# Altium schematic sheet fmc_connector.SchDoc: FMC Connector
size 420 x 297 mm; CheckedBy: MC, TW, EB; CompanyName: CERN; DrawnBy: Greg Kasprowicz; Organization: CERN; Address1: European Organization for Nuclear Research; Address2: CH-1211 Geneve 23 - SwitzerLA_Pd; DocumentNumber: 3; Revision: -; SheetNumber: 3; SheetTotal: 17; EDA_Number: EDA-02189-V4-0; Projet: Simple PCIe Carrier Board; ModifiedBy: TW, MC; CreateDate: 10/07/2010; CheckedDate: 11/05/2011; DivGrp: BE-CO; Designer: GK, MC, TW, EB, PAS; PageSetup: Record=PageOptions|CenterHorizontal=True|CenterVertical=True|PrintScale=0.96|XCorrection=1.00|YCorrection=1.00|PrintKind=1|BorderSize=5000000|LeftOffset=0|BottomOffset=0|Orientation=2|PaperLength=1000|PaperWidth=1000|Scale=100|PaperSource=15|PrintQuality=600|MediaType=1|DitherType=10|PaperKind=A3|PrintScaleMode=1; ModifiedDate: -
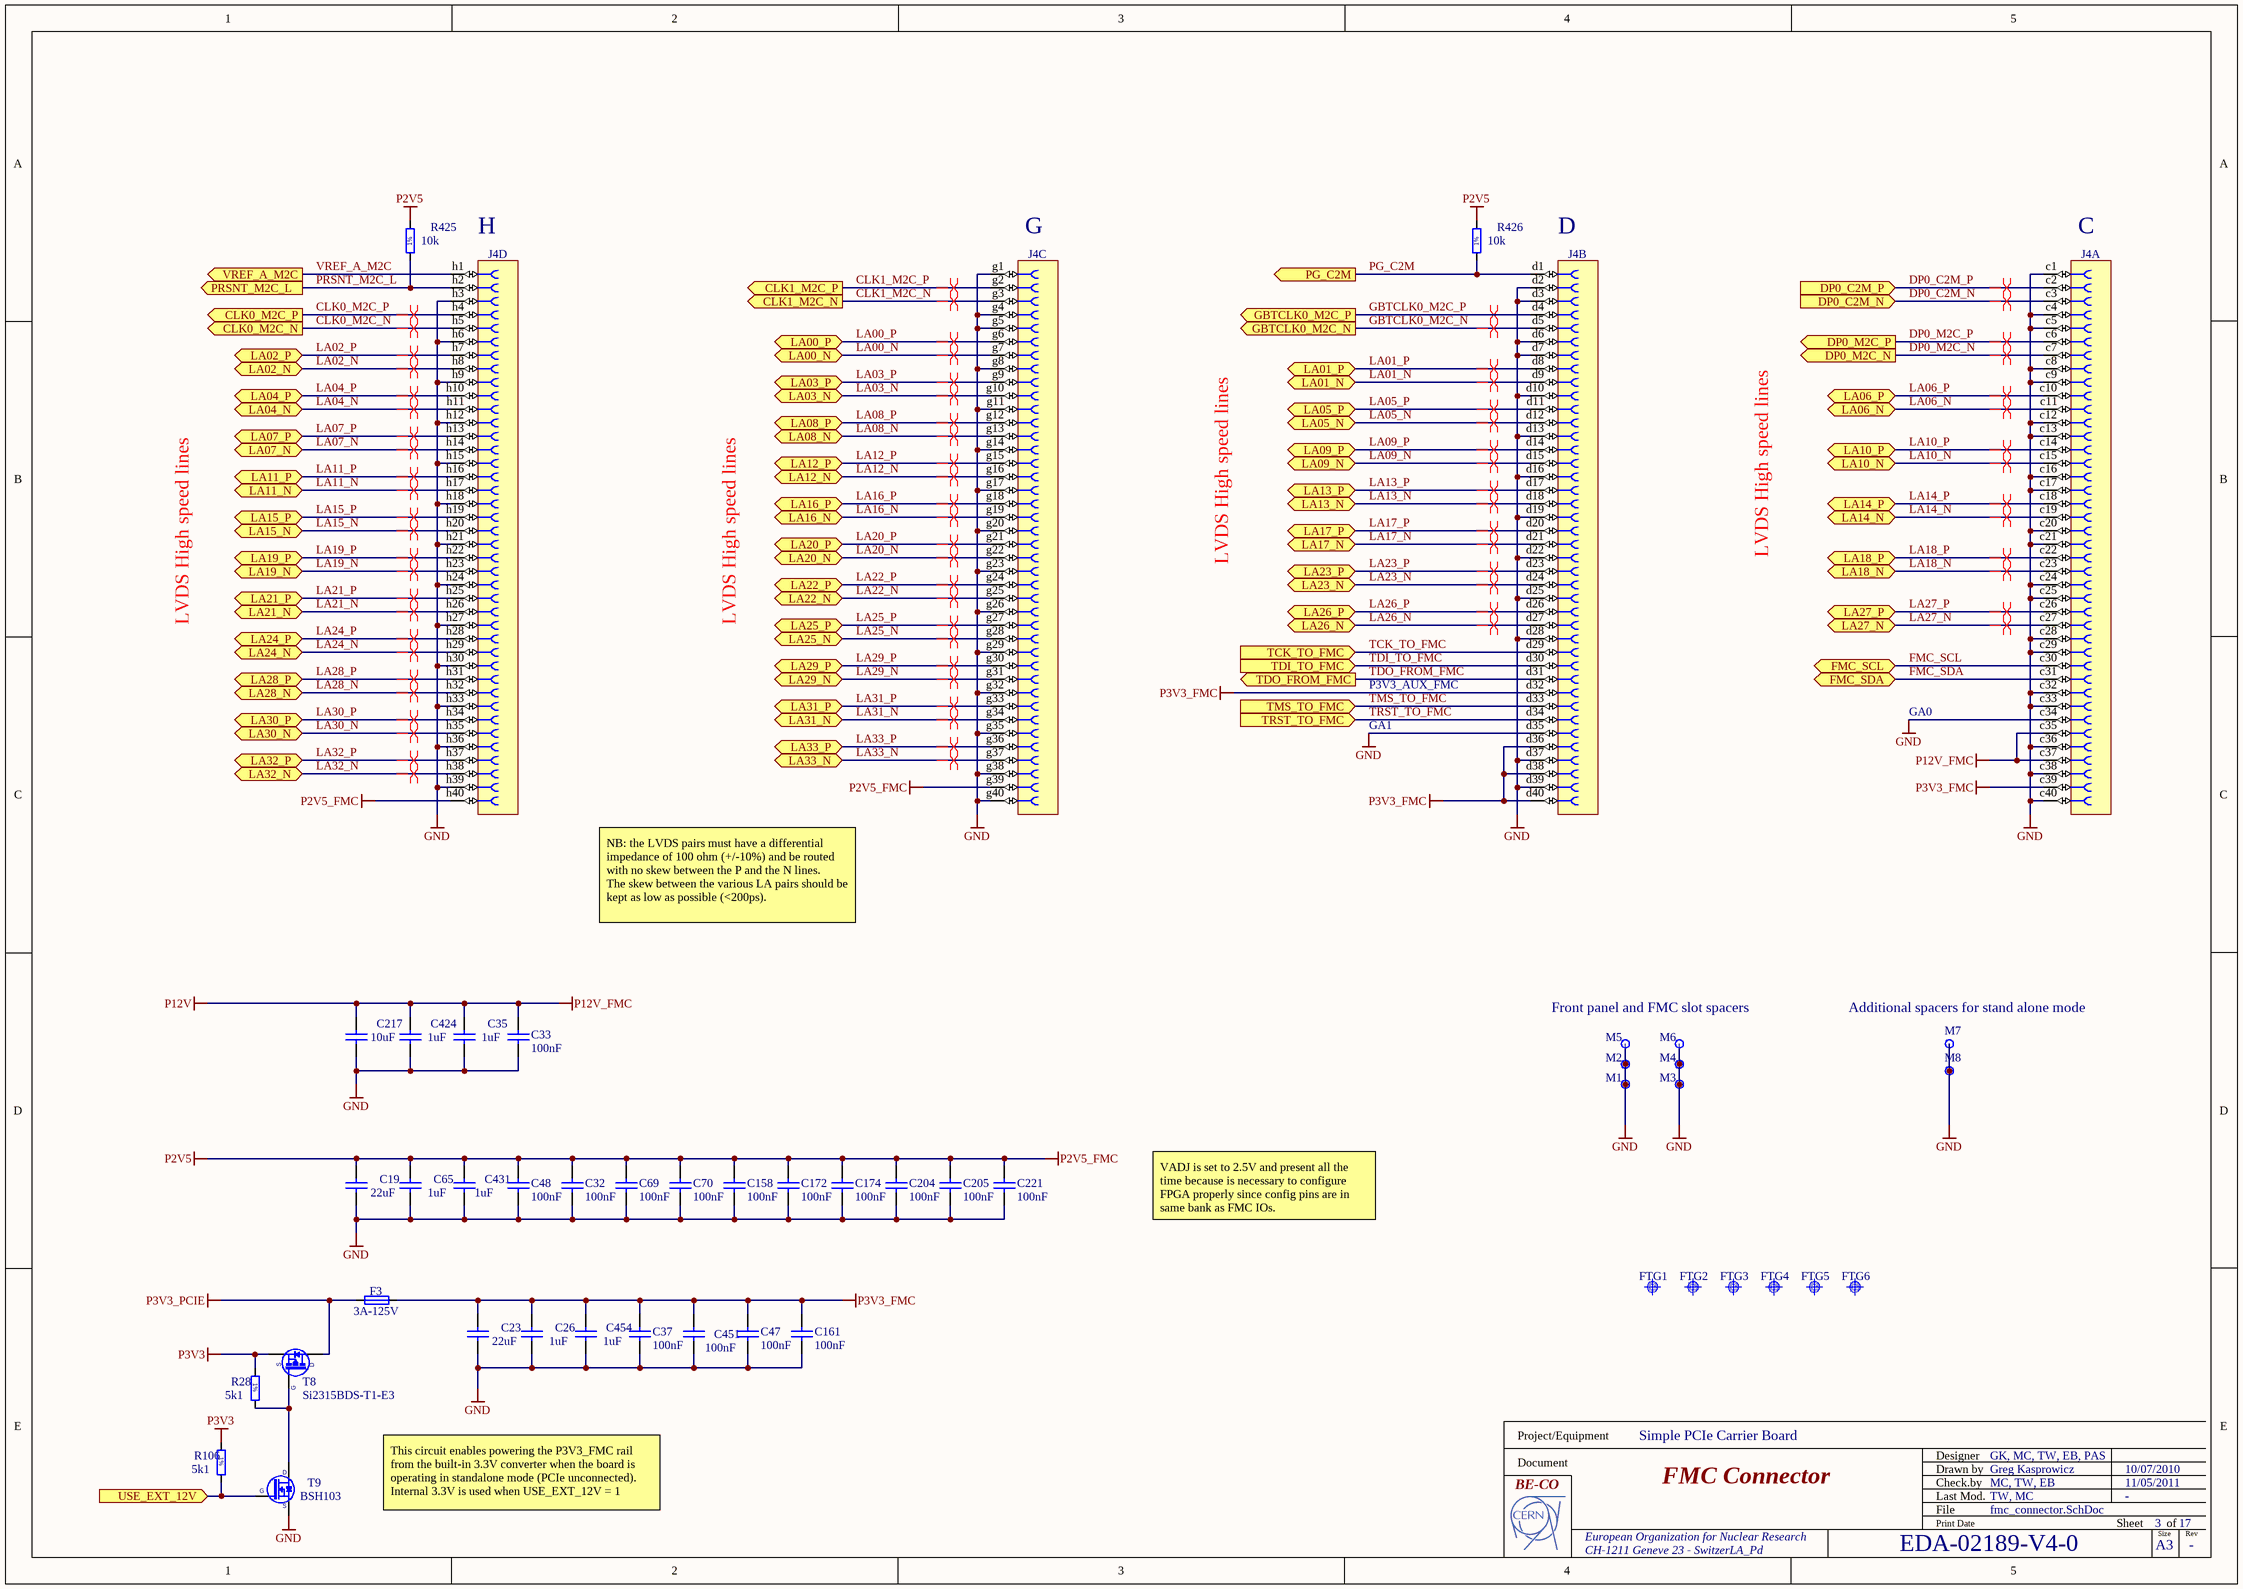
[diagram p0: fmc_connector.SchDoc]

## Parts
C19  22uF  [CAPC3216X180N]
C23  22uF  [CAPC3216X180N]
C26  1uF  [CAPC1608X87N]
C32  100nF  [CAPC1608X87N]
C33  100nF  [CAPC1608X87N]
C35  1uF  [CAPC1608X87N]
C37  100nF  [CAPC1608X87N]
C47  100nF  [CAPC1608X87N]
C48  100nF  [CAPC1608X87N]
C65  1uF  [CAPC1608X87N]
C69  100nF  [CAPC1608X87N]
C70  100nF  [CAPC1608X87N]
C158  100nF  [CAPC1608X87N]
C161  100nF  [CAPC1608X87N]
C172  100nF  [CAPC1608X87N]
C174  100nF  [CAPC1608X87N]
C204  100nF  [CAPC1608X87N]
C205  100nF  [CAPC1608X87N]
C217  10uF  [CAPC3225X270N]
C221  100nF  [CAPC1608X87N]
C424  1uF  [CAPC1608X87N]
C431  1uF  [CAPC1608X87N]
C451  100nF  [CAPC1608X87N]
C454  1uF  [CAPC1608X87N]
F3  3A-125V  [FUSE_LITTELFUSE_0154]
FTG1  Use only in PCB  [FIDUCIAL_TOP_S100-200]  (value not drawn)
FTG2  Use only in PCB  [FIDUCIAL_TOP_S100-200]  (value not drawn)
FTG3  Use only in PCB  [FIDUCIAL_TOP_S100-200]  (value not drawn)
FTG4  Use only in PCB  [FIDUCIAL_TOP_S100-200]  (value not drawn)
FTG5  Use only in PCB  [FIDUCIAL_TOP_S100-200]  (value not drawn)
FTG6  Use only in PCB  [FIDUCIAL_TOP_S100-200]  (value not drawn)
J4  VITA 57  [SAMTEC_ASP-134603-01]  (value not drawn)  (parts A,B,C,D of 4)
M1  Plated Hole  [MTG300_600]  (value not drawn)
M2  Plated Hole  [MTG300_600]  (value not drawn)
M3  Plated Hole  [MTG300_600]  (value not drawn)
M4  Plated Hole  [MTG300_600]  (value not drawn)
M5  Plated Hole  [MTG300_600]  (value not drawn)
M6  Plated Hole  [MTG300_600]  (value not drawn)
M7  Plated Hole  [MTG300_600]  (value not drawn)
M8  Plated Hole  [MTG300_600]  (value not drawn)
R28  5k1  [RESC1608X55N]
R106  5k1  [RESC1608X55N]
R425  10k  [RESC1608X55N]
R426  10k  [RESC1608X55N]
T8  Si2315BDS-T1-E3  [SOT95P237X112-3N]
T9  BSH103  [SOT95P230X110-3N]

## Ports
CLK0_M2C_N (out), CLK0_M2C_P (out), CLK1_M2C_N (out), CLK1_M2C_P (out), DP0_C2M_N (in), DP0_C2M_P (in), DP0_M2C_N (out), DP0_M2C_P (out), FMC_SCL (bidir), FMC_SDA (bidir), GBTCLK0_M2C_N (out), GBTCLK0_M2C_P (out), LA00_N (bidir), LA00_P (bidir), LA01_N (bidir), LA01_P (bidir), LA02_N (bidir), LA02_P (bidir), LA03_N (bidir), LA03_P (bidir), LA04_N (bidir), LA04_P (bidir), LA05_N (bidir), LA05_P (bidir), LA06_N (bidir), LA06_P (bidir), LA07_N (bidir), LA07_P (bidir), LA08_N (bidir), LA08_P (bidir), LA09_N (bidir), LA09_P (bidir), LA10_N (bidir), LA10_P (bidir), LA11_N (bidir), LA11_P (bidir), LA12_N (bidir), LA12_P (bidir), LA13_N (bidir), LA13_P (bidir), LA14_N (bidir), LA14_P (bidir), LA15_N (bidir), LA15_P (bidir), LA16_N (bidir), LA16_P (bidir), LA17_N (bidir), LA17_P (bidir), LA18_N (bidir), LA18_P (bidir), LA19_N (bidir), LA19_P (bidir), LA20_N (bidir), LA20_P (bidir), LA21_N (bidir), LA21_P (bidir), LA22_N (bidir), LA22_P (bidir), LA23_N (bidir), LA23_P (bidir), LA24_N (bidir), LA24_P (bidir), LA25_N (bidir), LA25_P (bidir), LA26_N (bidir), LA26_P (bidir), LA27_N (bidir), LA27_P (bidir), LA28_N (bidir), LA28_P (bidir), LA29_N (bidir), LA29_P (bidir), LA30_N (bidir), LA30_P (bidir), LA31_N (bidir), LA31_P (bidir), LA32_N (bidir), LA32_P (bidir), LA33_N (bidir), LA33_P (bidir), PG_C2M (out), PRSNT_M2C_L (out), TCK_TO_FMC (in), TDI_TO_FMC (in), TDO_FROM_FMC (out), TMS_TO_FMC (in), TRST_TO_FMC (in), USE_EXT_12V (in), VREF_A_M2C (out)

## Nets
GND: C19.1 C23.1 C26.1 C32.1 C33.1 C35.1 C37.1 C47.1 C48.1 C65.1 C69.1 C70.1 C158.1 C161.1 C172.1 C174.1 C204.1 C205.1 C217.2 C221.1 C424.1 C431.1 C451.1 C454.1 J4.c1 J4.c4 J4.c5 J4.c8 J4.c9 J4.c12 J4.c13 J4.c16 J4.c17 J4.c20 J4.c21 J4.c24 J4.c25 J4.c28 J4.c29 J4.c32 J4.c33 J4.c34 J4.c36 J4.c38 J4.c40 J4.d2 J4.d3 J4.d6 J4.d7 J4.d10 J4.d13 J4.d16 J4.d19 J4.d22 J4.d25 J4.d28 J4.d35 J4.d37 J4.d39 J4.g1 J4.g4 J4.g5 J4.g8 J4.g11 J4.g14 J4.g17 J4.g20 J4.g23 J4.g26 J4.g29 J4.g32 J4.g35 J4.g38 J4.g40 J4.h3 J4.h6 J4.h9 J4.h12 J4.h15 J4.h18 J4.h21 J4.h24 J4.h27 J4.h30 J4.h33 J4.h36 J4.h39 M1.1 M2.1 M3.1 M4.1 M5.1 M6.1 M7.1 M8.1 T9.2(S)
P2V5: C19.2 C32.2 C48.2 C65.2 C69.2 C70.2 C158.2 C172.2 C174.2 C204.2 C205.2 C221.2 C431.2 J4.g39 J4.h40 R425.2 R426.2  [also labelled P2V5_FMC]
P3V3: R28.1 R106.1 T8.2(S)
P3V3_FMC: C23.2 C26.2 C37.2 C47.2 C161.2 C451.2 C454.2 F3.2 J4.c39 J4.d32 J4.d36 J4.d38 J4.d40
P3V3_PCIE: F3.1 T8.3(D)
P12V: C33.2 C35.2 C217.1 C424.2 J4.c35 J4.c37  [also labelled P12V_FMC]
CLK0_M2C_N: J4.h5 ; port CLK0_M2C_N
CLK0_M2C_P: J4.h4 ; port CLK0_M2C_P
CLK1_M2C_N: J4.g3 ; port CLK1_M2C_N
CLK1_M2C_P: J4.g2 ; port CLK1_M2C_P
DP0_C2M_N: J4.c3 ; port DP0_C2M_N
DP0_C2M_P: J4.c2 ; port DP0_C2M_P
DP0_M2C_N: J4.c7 ; port DP0_M2C_N
DP0_M2C_P: J4.c6 ; port DP0_M2C_P
FMC_SCL: J4.c30 ; port FMC_SCL
FMC_SDA: J4.c31 ; port FMC_SDA
GBTCLK0_M2C_N: J4.d5 ; port GBTCLK0_M2C_N
GBTCLK0_M2C_P: J4.d4 ; port GBTCLK0_M2C_P
LA00_N: J4.g7 ; port LA00_N
LA00_P: J4.g6 ; port LA00_P
LA01_N: J4.d9 ; port LA01_N
LA01_P: J4.d8 ; port LA01_P
LA02_N: J4.h8 ; port LA02_N
LA02_P: J4.h7 ; port LA02_P
LA03_N: J4.g10 ; port LA03_N
LA03_P: J4.g9 ; port LA03_P
LA04_N: J4.h11 ; port LA04_N
LA04_P: J4.h10 ; port LA04_P
LA05_N: J4.d12 ; port LA05_N
LA05_P: J4.d11 ; port LA05_P
LA06_N: J4.c11 ; port LA06_N
LA06_P: J4.c10 ; port LA06_P
LA07_N: J4.h14 ; port LA07_N
LA07_P: J4.h13 ; port LA07_P
LA08_N: J4.g13 ; port LA08_N
LA08_P: J4.g12 ; port LA08_P
LA09_N: J4.d15 ; port LA09_N
LA09_P: J4.d14 ; port LA09_P
LA10_N: J4.c15 ; port LA10_N
LA10_P: J4.c14 ; port LA10_P
LA11_N: J4.h17 ; port LA11_N
LA11_P: J4.h16 ; port LA11_P
LA12_N: J4.g16 ; port LA12_N
LA12_P: J4.g15 ; port LA12_P
LA13_N: J4.d18 ; port LA13_N
LA13_P: J4.d17 ; port LA13_P
LA14_N: J4.c19 ; port LA14_N
LA14_P: J4.c18 ; port LA14_P
LA15_N: J4.h20 ; port LA15_N
LA15_P: J4.h19 ; port LA15_P
LA16_N: J4.g19 ; port LA16_N
LA16_P: J4.g18 ; port LA16_P
LA17_N: J4.d21 ; port LA17_N
LA17_P: J4.d20 ; port LA17_P
LA18_N: J4.c23 ; port LA18_N
LA18_P: J4.c22 ; port LA18_P
LA19_N: J4.h23 ; port LA19_N
LA19_P: J4.h22 ; port LA19_P
LA20_N: J4.g22 ; port LA20_N
LA20_P: J4.g21 ; port LA20_P
LA21_N: J4.h26 ; port LA21_N
LA21_P: J4.h25 ; port LA21_P
LA22_N: J4.g25 ; port LA22_N
LA22_P: J4.g24 ; port LA22_P
LA23_N: J4.d24 ; port LA23_N
LA23_P: J4.d23 ; port LA23_P
LA24_N: J4.h29 ; port LA24_N
LA24_P: J4.h28 ; port LA24_P
LA25_N: J4.g28 ; port LA25_N
LA25_P: J4.g27 ; port LA25_P
LA26_N: J4.d27 ; port LA26_N
LA26_P: J4.d26 ; port LA26_P
LA27_N: J4.c27 ; port LA27_N
LA27_P: J4.c26 ; port LA27_P
LA28_N: J4.h32 ; port LA28_N
LA28_P: J4.h31 ; port LA28_P
LA29_N: J4.g31 ; port LA29_N
LA29_P: J4.g30 ; port LA29_P
LA30_N: J4.h35 ; port LA30_N
LA30_P: J4.h34 ; port LA30_P
LA31_N: J4.g34 ; port LA31_N
LA31_P: J4.g33 ; port LA31_P
LA32_N: J4.h38 ; port LA32_N
LA32_P: J4.h37 ; port LA32_P
LA33_N: J4.g37 ; port LA33_N
LA33_P: J4.g36 ; port LA33_P
PG_C2M: J4.d1 R426.1 ; port PG_C2M
PRSNT_M2C_L: J4.h2 R425.1 ; port PRSNT_M2C_L
TCK_TO_FMC: J4.d29 ; port TCK_TO_FMC
TDI_TO_FMC: J4.d30 ; port TDI_TO_FMC
TDO_FROM_FMC: J4.d31 ; port TDO_FROM_FMC
TMS_TO_FMC: J4.d33 ; port TMS_TO_FMC
TRST_TO_FMC: J4.d34 ; port TRST_TO_FMC
USE_EXT_12V: R106.2 T9.1(G) ; port USE_EXT_12V
VREF_A_M2C: J4.h1 ; port VREF_A_M2C
NetR28_2: R28.2 T8.1(G) T9.3(D)

## Layout directives
differential pair: CLK0_M2C_N, CLK0_M2C_P, CLK1_M2C_N, CLK1_M2C_P, DP0_C2M_N, DP0_C2M_P, DP0_M2C_N, DP0_M2C_P, GBTCLK0_M2C_N, GBTCLK0_M2C_P, LA00_N, LA00_P, LA01_N, LA01_P, LA02_N, LA02_P, LA03_N, LA03_P, LA04_N, LA04_P, LA05_N, LA05_P, LA06_N, LA06_P, LA07_N, LA07_P, LA08_N, LA08_P, LA09_N, LA09_P, LA10_N, LA10_P, LA11_N, LA11_P, LA12_N, LA12_P, LA13_N, LA13_P, LA14_N, LA14_P, LA15_N, LA15_P, LA16_N, LA16_P, LA17_N, LA17_P, LA18_N, LA18_P, LA19_N, LA19_P, LA20_N, LA20_P, LA21_N, LA21_P, LA22_N, LA22_P, LA23_N, LA23_P, LA24_N, LA24_P, LA25_N, LA25_P, LA26_N, LA26_P, LA27_N, LA27_P, LA28_N, LA28_P, LA29_N, LA29_P, LA30_N, LA30_P, LA31_N, LA31_P, LA32_N, LA32_P, LA33_N, LA33_P

## Notes on the sheet
- (near J4) H
- (near J4) G
- (near J4) D
- (near J4) C
- LVDS High speed lines
- GA1
- P3V3_AUX_FMC
- GA0
- NB: the LVDS pairs must have a differential impedance of 100 ohm (+/-10%) and be routed with no skew between the P and the N lines.
  The skew between the various LA pairs should be kept as low as possible (<200ps).
- Front panel and FMC slot spacers
- (near M7) Additional spacers for stand alone mode
- VADJ is set to 2.5V and present all the time because is necessary to configure FPGA properly since config pins are in same bank as FMC IOs.
- This circuit enables powering the P3V3_FMC rail from the built-in 3.3V converter when the board is operating in standalone mode (PCIe unconnected).
  Internal 3.3V is used when USE_EXT_12V = 1
- Project/Equipment
- Document
- Designer
- Drawn by
- Check.by
- File
- Last Mod.
- Print Date
- Sheet
- Size
- A3
- of
- Rev
- (in symbol R0603_5K1_1%_0.1W_100PPM) 1%
- (in symbol R0603_10K_1%_0.1W_100PPM) 1%

## Library data of the parts
C19 C23 = CC1206_22UF_10V_10%_X7R: Non-polarised capacitor; Part Description: SMD Multilayer Chip Ceramic Capacitor; Manufacturer: GENERIC; Manufacturer1 Part Number: GRM31CR71A226KE15L; Voltage: 10V; TC: X7R; Tolerance: ±10%; Table: Capacitors SMD; Part Number: CC1206_22UF_10V_10%_X7R; Component Kind: Standard; Component Type: Standard; Pin Count: 2; Value: 22uF; Status: Preferred; Manufacturer Part Number: CC1206_22UF_10V_10%_X7R; Case: 1206; Mounted: Yes; Socket: No; SMD: Yes; Manufacturer1 Example: MURATA; Manufacturer1 ComponentHeight: 1.8mm; HelpURL: \\cern.ch\dfs\Applications\Altium\Datasheets\CC1206_X7R_MURATA_GRM-HI-CAP.pdf; Author: CERN DEM JLC; CreateDate: 2010-06-08; LatestRevisionDate: 2010-06-08
C26 C454 = CC0603_1UF_16V_10%_X7R: Non-polarised capacitor; Part Description: SMD Multilayer Chip Ceramic Capacitor; Manufacturer: GENERIC; Manufacturer1 Part Number: 223824613663; Manufacturer1 Datasheet: \\cern.ch\dfs\Applications\Altium\Datasheets\CC0805_X5R_PHYCOMP_HC.pdf; Voltage: 16V; TC: X7R; Tolerance: ±10%; Table: Capacitors SMD; Part Number: CC0603_1UF_16V_10%_X7R; Component Kind: Standard; Component Type: Standard; Designator: Capacitor - non polarized; Library Reference: Capacitor - non polarized; Pin Count: 2; Value: 1uF; Status: Preferred; Manufacturer Part Number: CC0603_1uF_16V_10%_X7R; Case: 0603; Mounted: Yes; Socket: No; SMD: Yes; Manufacturer1 Example: PHYCOMP; Manufacturer1 ComponentHeight: 0.87mm; HelpURL: \\cern.ch\dfs\Applications\Altium\Datasheets\CC0805_X5R_PHYCOMP_HC.pdf; Author: CERN DEM JLC; CreateDate: 03/12/2007; LatestRevisionDate: 03/12/2007
C32 C33 C37 C47 C48 C69 C70 C158 C161 C172 C174 C204 C205 C221 C451 = CC0603_100NF_50V_10%_X7R: Non-polarised capacitor; Part Description: SMD Multilayer Chip Ceramic Capacitor; Manufacturer: GENERIC; Manufacturer1 Part Number: 223858615649; Voltage: 50V; TC: X7R; Tolerance: ±10%; Table: Capacitors SMD; Part Number: CC0603_100NF_50V_10%_X7R; Component Kind: Standard; Component Type: Standard; Pin Count: 2; Value: 100nF; Status: Preferred; Manufacturer Part Number: CC0603_100NF_50V_10%_X7R; Case: 0603; Mounted: Yes; Socket: No; SMD: Yes; Manufacturer1 Example: PHYCOMP; Manufacturer1 ComponentHeight: 0.87mm; HelpURL: \\cern.ch\dfs\Applications\Altium\Datasheets\CC0603_X7R_PHYCOMP.pdf; Author: CERN DEM JLC; CreateDate: 03/12/2007; LatestRevisionDate: 03/12/2007
C35 C65 C424 C431 = CC0603_1UF_16V_10%_X7R: Non-polarised capacitor; Part Description: SMD Multilayer Chip Ceramic Capacitor; Manufacturer: GENERIC; Manufacturer1 Part Number: 223824613663; Voltage: 16V; TC: X7R; Tolerance: ±10%; Table: Capacitors SMD; Part Number: CC0603_1UF_16V_10%_X7R; Component Kind: Standard; Component Type: Standard; Pin Count: 2; Value: 1uF; Status: Preferred; Manufacturer Part Number: CC0603_1uF_16V_10%_X7R; Case: 0603; Mounted: Yes; Socket: No; SMD: Yes; Manufacturer1 Example: PHYCOMP; Manufacturer1 ComponentHeight: 0.87mm; HelpURL: \\cern.ch\dfs\Applications\Altium\Datasheets\CC0805_X5R_PHYCOMP_HC.pdf; Author: CERN DEM JLC
  C35 C424 C431: CreateDate: 03/12/2007; LatestRevisionDate: 03/12/2007
  C65: CreateDate: 12/3/2007; LatestRevisionDate: 12/3/2007
C217 = CC1210_10UF_25V_10%_X7R: Non-polarised capacitor; Part Description: SMD Multilayer Chip Ceramic Capacitor; Manufacturer: GENERIC; Manufacturer1 Part Number: C1210C106K3RAC; Voltage: 25V; TC: X7R; Tolerance: ±10%; Table: Capacitors SMD; Part Number: CC1210_10UF_25V_10%_X7R; Component Kind: Standard; Component Type: Standard; Pin Count: 2; Value: 10uF; Status: None; Manufacturer Part Number: CC1210_10UF_25V_10%_X7R; Case: 1210; Mounted: Yes; Socket: No; SMD: Yes; Manufacturer1 Example: KEMET; Manufacturer1 ComponentHeight: 2.7mm; HelpURL: \\cern.ch\dfs\Applications\Altium\Datasheets\CC1210_X7R_KEMET.pdf; Author: CERN DEM JLC; CreateDate: 5/5/2009; LatestRevisionDate: 4/1/2010
F3 = FUSE_LITTELFUSE_0154003.DR: Fuse; Part Description: SMF OMNI-BLOK® Very Fast-Acting Fuse and Holder; Table: Fuses; Part Number: FUSE_LITTELFUSE_0154003.DR; Component Kind: Standard; Component Type: Standard; Pin Count: 2; PackageDescription: SMF Fuse and Holder, 2-Leads, Body 9.73x5.03mm; Family: Fuse & Holder; Mounted: Yes; Socket: No; SMD: Yes; Value: 3A-125V; Manufacturer: LITTELFUSE; Manufacturer Part Number: 0154003.DR; ComponentHeight: 3.81mm; HelpURL: \\cern.ch\dfs\Applications\Altium\Datasheets\FUSE_LITTELFUSE_0154.pdf; Author: CERN DEM JMW; CreateDate: 1/8/2009; LatestRevisionDate: 1/8/2009
FTG1-FTG6 = FIDUCIAL_TARGET_S100-200: Fiducial Target; Part Description: Scare Fiducial Target, Top Layer, 1.0mm, Top Sloder 2.0mm, Keepout =2.0mm; Mounted: No; Table: Pads; Part Number: FIDUCIAL_TARGET_S100-200; Component Kind: Standard (No BOM); Component Type: Standard (No BOM); Pin Count: 1; Family: Fiducial; Socket: No; SMD: Yes; Status: None; ComponentHeight: 0mm; Author: CERN DEM JLC; CreateDate: 09.02.2010; LatestRevisionDate: 09.02.2010; PackageDescription: Scare Fiducial Target, Top Layer, 1.0mm, Top Sloder 2.0mm, Keepout =2.0mm
J4 = SAMTEC_ASP-134603-01: Connector VITA 57, 160 Female contacts in 4 row cdgh; Part Description: 160 contacts (4 rows cdgh) Surface Mount Female Connector, VITA 57; Manufacturer: SAMTEC; Part Number: SAMTEC_ASP-134603-01; Component Kind: Standard; Component Type: Standard; Pin Count: 160; Family: VITA 57; Mounted: Yes; Socket: No; SMD: Yes; Status: None; Manufacturer Part Number: ASP-134603-01; ComponentHeight: 6.55mm; HelpURL: \\cern.ch\dfs\Applications\Altium\Datasheets\SAMTEC_ASP-134603-01.pdf; Author: CERN DEM JLC; CreateDate: 2010-07-13; LatestRevisionDate: 2010-07-13; Table: SAMTEC
M1-M8 = PLATED_HOLE3.0_PAD6.0: Single Terminal Socket; Part Description: Plated Through Hole: Hole Dia.=3.0mm Pad Dia.=6.0mm; Mounted: No; Table: Pads; Part Number: PLATED_HOLE3.0_PAD6.0; Component Kind: Standard (No BOM); Component Type: Standard (No BOM); Designator: Single Terminal Socket; Library Reference: Single Terminal Socket; Pin Count: 1; Family: Plated Hole; Socket: No; SMD: No; Status: None; ComponentHeight: 0mm; Author: CERN DEM JLC; CreateDate: 26.05.2008; LatestRevisionDate: 26.05.2008; PackageDescription: Plated Through Hole: Hole Dia.=3.0mm Pad Dia.=6.0mm
R28 R106 = R0603_5K1_1%_0.1W_100PPM: Resistor - 1%; Part Description: General Purpose Thick Film Chip Resistor; Manufacturer: GENERIC; Manufacturer1 Part Number: NRC06F5101TRF; Power: 0.1W; TC: ±100ppm/°C; Table: Resistors SMD; Part Number: R0603_5K1_1%_0.1W_100PPM; Component Kind: Standard; Component Type: Standard; Pin Count: 2; Value: 5k1; Status: Preferred; Tolerance: ±1%; Manufacturer Part Number: R0603_5K1_1%_0.1W_100PPM; Case: 0603; Mounted: Yes; Socket: No; SMD: Yes; Manufacturer1 Example: NIC COMPONENT; Manufacturer1 ComponentHeight: 0.55mm; HelpURL: \\cern.ch\dfs\Applications\Altium\Datasheets\R0603_NIC_NRC.pdf; Author: CERN DEM JLC; CreateDate: 03/12/2007; LatestRevisionDate: 13/03/2008
R425 R426 = R0603_10K_1%_0.1W_100PPM: Resistor - 1%; Part Description: General Purpose Thick Film Chip Resistor; Manufacturer: GENERIC; Manufacturer1 Part Number: NRC06F1002TRF; Power: 0.1W; TC: ±100ppm/°C; Table: Resistors SMD; Part Number: R0603_10K_1%_0.1W_100PPM; Component Kind: Standard; Component Type: Standard; Pin Count: 2; Value: 10k; Status: Preferred; Tolerance: ±1%; Manufacturer Part Number: R0603_10K_1%_0.1W_100PPM; Case: 0603; Mounted: Yes; Socket: No; SMD: Yes; Manufacturer1 Example: NIC COMPONENT; Manufacturer1 ComponentHeight: 0.55mm; HelpURL: \\cern.ch\dfs\Applications\Altium\Datasheets\R0603_NIC_NRC.pdf; Author: CERN DEM JLC; CreateDate: 03/12/2007; LatestRevisionDate: 13/03/2008
T8 = Si2315BDS-T1-E3: P-CHANNEL MOSFET WITH DIODE; Part Description: -12V -3A P-Channel STripFET® II Power MOSFET; Manufacturer: VISHAY SILICONIX; Table: Transistors; Part Number: Si2315BDS-T1-E3; Component Kind: Standard; Component Type: Standard; Device: Si2315BDS-T1-E3; PackageDescription: SOT, 0.95mm, pitch; 3 pin,1.30mm W X 2.92mm L X 1.12mm H body, IPC Medium Density; Manufacturer Part Number: Si2315BDS-T1-E3; Pin Count: 3; Case: SOT23-3; Mounted: Yes; Socket: No; SMD: Yes; ComponentHeight: 1.12mm; HelpURL: \\cern.ch\dfs\Applications\Altium\Datasheets\Si2315BDS-T1-E3.pdf; Author: CERN DEM JLC; CreateDate: 5/2/2011; LatestRevisionDate: 5/2/2011
T9 = BSH103: N-CHANNEL MOSFET WITH DIODE; Part Description: 50V 200mA N-Channel Enhancement Mode Field-Effect Transistor; Manufacturer: NXP SEMICONDUCTORS; Table: Transistors; Part Number: BSH103; Component Kind: Standard; Component Type: Standard; Device: BSH103; PackageDescription: SOT23, 3 pin, Pitch 0.95mm - 1.3mm W X 2.9mm L X 1.1mm H, IPC Medium Density; Manufacturer Part Number: BSH103; Pin Count: 3; Case: SOT23-3; Mounted: Yes; Socket: No; SMD: Yes; ComponentHeight: 1.1mm; HelpURL: \\cern.ch\dfs\Applications\Altium\Datasheets\BSH103.pdf; Author: CERN DEM JLC; CreateDate: 3/16/2010; LatestRevisionDate: 3/16/2010